# EAGLE design aardvark-v0.80 (EAGLE 9.6.2)
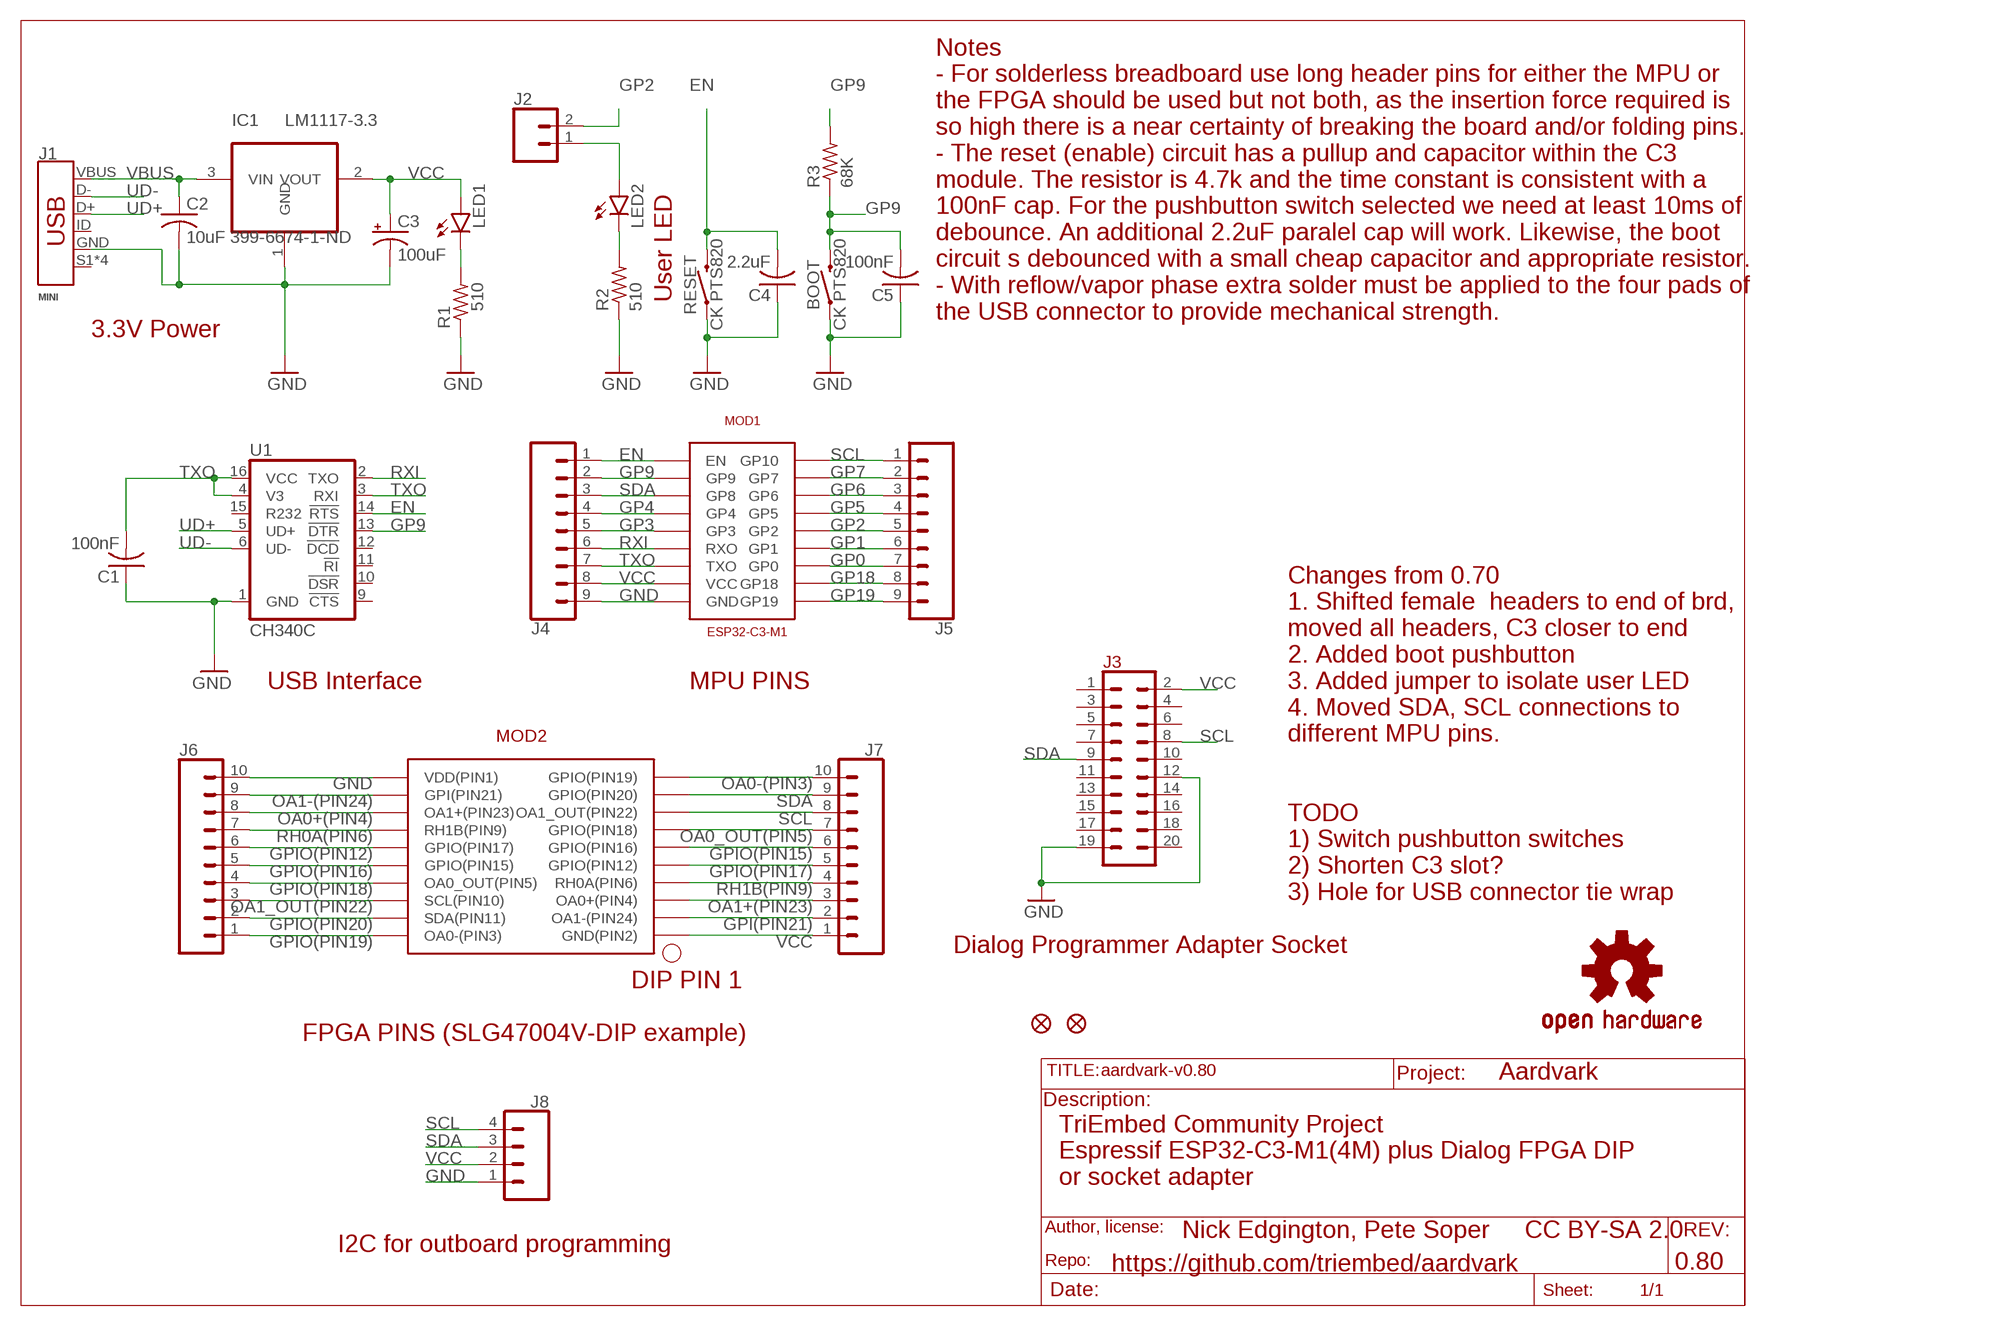
[diagram p0: schematic, sheet 1]

## Parts
BOOT  CK PTS820  MOMENTARY-SWITCH-SPST-SMD-6.0X3.5MM  [TACTILE_SWITCH_SMD_6.0X3.5MM]
C1  100nF  C-USC0805  [C0805]
C2  10uF 399-6674-1-ND  C-USC0805  [C0805]
C3  100uF  47UF-POLAR-PANASONIC_D-50V-20%  [PANASONIC_D]
C4  2.2uF  C-USC0805  [C0805]
C5  100nF  C-USC0805  [C0805]
FD1  FIDUCIAL1X2  [FIDUCIAL-1X2]
FD2  FIDUCIAL1X2  [FIDUCIAL-1X2]
IC1  LM1117-3.3  REG1117  [SOT223]
J1  MINI  USB_MINI-B_SMT  [USB-MINIB]
J2  CONN_02  [1X02]
J3  CONN_10X2  [2X10]
J4  CONN_09NO_SILK  [1X09_NO_SILK]
J5  CONN_09NO_SILK  [1X09_NO_SILK]
J6  CONN_10NO_SILK_PTH_FEMALE  [1X10_NO_SILK]
J7  CONN_10NO_SILK_PTH_FEMALE  [1X10_NO_SILK]
J8  CONN_041X04_NO_SILK  [1X04_NO_SILK]
LED1  LEDCHIP-LED0805  [CHIP-LED0805]
LED2  LEDCHIP-LED0805  [CHIP-LED0805]
LOGO1  OSHW-LOGOMINI  [OSHW-LOGO-MINI]
MOD1  ESP32-C3-M1  AITHINKER-C3-M1  [AITHINKER-C3-M1]
MOD2  SLG47004V_DIP  [SLG47004V-DIP]
R1  510  R-US_R0805  [R0805]
R2  510  R-US_R0805  [R0805]
R3  68K  R-US_R0805  [R0805]
RESET  CK PTS820  MOMENTARY-SWITCH-SPST-SMD-6.0X3.5MM  [TACTILE_SWITCH_SMD_6.0X3.5MM]
U1  CH340C  [SO016]

## Nets
EN: C4.2 J4.1 MOD1.PIN1(EN) RESET.2 U1.14(!RTS)
GND [power]: BOOT.1 C1.1 C2.2 C3.- C4.1 C5.1 IC1.1(GND) J1.GND J3.12 J3.19 J4.9 J6.10 J8.1 MOD1.PIN9(GND) MOD2.1(VDD(PIN1)) R1.1 R2.1 RESET.1 U1.1(GND)
GP0: J5.7 MOD1.PIN12(GP0)
GP1: J5.6 MOD1.PIN13(GP1)
GP2: J2.1 J2.2 J5.5 LED2.A MOD1.PIN14(GP2)
GP3: J4.5 MOD1.PIN5(GP3)
GP4: J4.4 MOD1.PIN4(GP4)
GP5: J5.4 MOD1.PIN15(GP5)
GP6: J5.3 MOD1.PIN16(GP6)
GP7: J5.2 MOD1.PIN17(GP7)
GP9: BOOT.2 C5.2 J4.2 MOD1.PIN2(GP9) R3.1 R3.2 U1.13(!DTR)
GP18: J5.8 MOD1.PIN11(GP18)
GP19: J5.9 MOD1.PIN10(GP19)
GPI(PIN21): J7.2 MOD2.12(OA1-(PIN24))
GPIO(PIN12): J6.6 MOD2.5(GPIO(PIN17))
GPIO(PIN15): J7.6 MOD2.16(GPIO(PIN16))
GPIO(PIN16): J6.5 MOD2.6(GPIO(PIN15))
GPIO(PIN17): J7.5 MOD2.15(GPIO(PIN12))
GPIO(PIN18): J6.4 MOD2.7(OA0_OUT(PIN5))
GPIO(PIN19): J6.1 MOD2.10(OA0-(PIN3))
GPIO(PIN20): J6.2 MOD2.9(SDA(PIN11))
N$1: LED2.C R2.2
N$3: LED1.C R1.2
OA0+(PIN4): J6.8 MOD2.3(OA1+(PIN23))
OA0-(PIN3): J7.10 MOD2.20(GPIO(PIN19))
OA0_OUT(PIN5): J7.7 MOD2.17(GPIO(PIN18))
OA1+(PIN23): J7.3 MOD2.13(OA0+(PIN4))
OA1-(PIN24): J6.9 MOD2.2(GPI(PIN21))
OA1_OUT(PIN22): J6.3 MOD2.8(SCL(PIN10))
RH0A(PIN6): J6.7 MOD2.4(RH1B(PIN9))
RH1B(PIN9): J7.4 MOD2.14(RH0A(PIN6))
RXI: J4.6 MOD1.PIN6(RXO) U1.2(TXO)
SCL: J3.8 J5.1 J7.8 J8.4 MOD1.PIN18(GP10) MOD2.18(OA1_OUT(PIN22))
SDA: J3.9 J4.3 J7.9 J8.3 MOD1.PIN3(GP8) MOD2.19(GPIO(PIN20))
TXO: C1.2 J4.7 MOD1.PIN7(TXO) U1.3(RXI) U1.4(V3) U1.16(VCC)
UD+: J1.D+ U1.5(UD+)
UD-: J1.D- U1.6(UD-)
VBUS [power]: C2.1 IC1.3(VIN) J1.VBUS
VCC [power]: C3.+ IC1.2(VOUT) J3.2 J4.8 J7.1 J8.2 LED1.A MOD1.PIN8(VCC) MOD2.11(GND(PIN2))
Unconnected: J1.ID J1.S1(SHIELD) J1.S2(SHIELD) J1.S3(SHIELD) J1.S4(SHIELD) J3.1 J3.3 J3.4 J3.5 J3.6 J3.7 J3.10 J3.11 J3.13 J3.14 J3.15 J3.16 J3.17 J3.18 J3.20 U1.9(!CTS) U1.10(!DSR) U1.11(!RI) U1.12(!DCD) U1.15(R232)

## Notes on the sheet
- User LED
- Notes
  - For solderless breadboard use long header pins for either the MPU or
  the FPGA should be used but not both, as the insertion force required is
  so high there is a near certainty of breaking the board and/or folding pins.
  - The reset (enable) circuit has a pullup and capacitor within the C3
  module. The resistor is 4.7k and the time constant is consistent with a
  100nF cap. For the pushbutton switch selected we need at least 10ms of
  debounce. An additional 2.2uF paralel cap will work. Likewise, the boot
  circuit s debounced with a small cheap capacitor and appropriate resistor.
  - With reflow/vapor phase extra solder must be applied to the four pads of
  the USB connector to provide mechanical strength.
- 3.3V Power
- USB Interface | MPU PINS
- Changes from 0.70
  1. Shifted female  headers to end of brd,
  moved all headers, C3 closer to end
  2. Added boot pushbutton
  3. Added jumper to isolate user LED
  4. Moved SDA, SCL connections to
  different MPU pins.
- TODO
  1) Switch pushbutton switches
  2) Shorten C3 slot?
  3) Hole for USB connector tie wrap
- Dialog Programmer Adapter Socket
- DIP PIN 1
- FPGA PINS (SLG47004V-DIP example)
- Aardvark
- TriEmbed Community Project
  Espressif ESP32-C3-M1(4M) plus Dialog FPGA DIP
  or socket adapter
- Nick Edgington, Pete Soper     CC BY-SA 2.0
- I2C for outboard programming
- https://github.com/triembed/aardvark | 0.80

## Library data of the parts
BOOT RESET = SparkFun-Switches:MOMENTARY-SWITCH-SPST: Momentary Switch (Pushbutton) - SPST Normally-open (NO) SPST momentary switches (buttons, pushbuttons). Variants PTH-12MM - 12mm square, through-hole Momentary Pushbutton Switch - 12mm Square <https://www.sparkfun.com/products/9190> (COM-09190) PTH-6.0MM, PTH-6.0MM-KIT - 6.0mm square, through-hole Mini Pushbutton Switch <https://www.sparkfun.com/products/97> (COM-00097) KIT package intended for soldering kit's - only one side of pads' copper is exposed. PTH-RIGHT-ANGLE-KIT - Right-angle, through-hole Right Angle Tactile Button <https://www.sparkfun.com/products/10791> - Used on SparkFun BigTime Watch Kit <https://www.sparkfun.com/products/11734> SMD-12MM - 12mm square, surface-mount Tactile Button - SMD (12mm) <https://www.sparkfun.com/products/12993> (COM-12993) Used on SparkFun PicoBoard <https://www.sparkfun.com/products/11888> SMD-4.5MM - 4.5mm Square Trackball Switch Used on SparkFun Blackberry Trackballer Breakout <https://www.sparkfun.com/products/13169> SMD-4.6MMX2.8MM - 4.60mm x 2.80mm, surface mount Used on SparkFun SAMD21 Mini Breakout <https://www.sparkfun.com/products/13664> SMD-5.2MM, SMD-5.2-REDUNDANT - 5.2mm square, surface-mount Mini Pushbutton Switch - SMD <https://www.sparkfun.com/products/8720> (COM-08720) Used on Arduino Pro Mini <https://www.sparkfun.com/products/11114> REDUNDANT package connects both switch circuits together SMD-6.0X3.5MM - 6.0 x 3.5mm, surface mount Momentary Reset Switch SMD <https://www.sparkfun.com/products/8229> (COM-08229) SMD-6.2MM-TALL - 6.2mm square, surface mount Tactile Button - SMD (6mm) <https://www.sparkfun.com/products/12992> Used on SparkFun Digital Sandbox <https://www.sparkfun.com/products/12651> SMD-RIGHT-ANGLE - Right-angle, surface mount Used on SparkFun Block for Intel® Edison - Arduino <https://www.sparkfun.com/products/13036>; PROD_ID: SWCH-14278; SF_SKU: COM-08229
C1 C2 C4 C5 = rcl:C-US: CAPACITOR, American symbol; SPICEPREFIX: C
C3 = SparkFun-Capacitors:47UF-POLAR: 47µF polarized capacitors A capacitor is a passive two-terminal electrical component used to store electrical energy temporarily in an electric field.
FD1 FD2 = apexprotofactory:FIDUCIAL: Fiducial Alignment Points Derived from SparkFun library but with cream (paste) included in pad. This is necessary for stencil creation by OSH Stencils!!
IC1 = burr-brown:REG1117: 800mA and 1A Low Dropout (LDO) Positive Regulator 1.8V, 2.5V, 2.85V, 3.3V, 5V, and Adj; MPN: REG1117; OC_FARNELL: 1097566; OC_NEWARK: 14P6981
J1 = SparkFun-Connectors:USB_MINI-B: USB type Mini-B Connector Breaks out 5th pin, and includes shield pins if needed. SparkFun Products: SparkFun FTDI Basic Breakout <https://www.sparkfun.com/products/9716> SparkFun XBee Explorer USB <https://www.sparkfun.com/products/11812> SparkFun Redboard <https://www.sparkfun.com/products/12757>; PROD_ID: CONN-08193; SF_ID: PRT-00587
J2 = SparkFun-Connectors:CONN_02: Multi connection point. Often used as Generic Header-pin footprint for 0.1 inch spaced/style header connections On any of the 0.1 inch spaced packages, you can populate with these: Break Away Headers - Straight <https://www.sparkfun.com/products/116> (PRT-00116) Break Away Male Headers - Right Angle <https://www.sparkfun.com/products/553> (PRT-00553) Female Headers <https://www.sparkfun.com/products/115> (PRT-00115) Break Away Headers - Machine Pin <https://www.sparkfun.com/products/117> (PRT-00117) Break Away Female Headers - Swiss Machine Pin <https://www.sparkfun.com/products/743> (PRT-00743) For SCREWTERMINALS and SPRING TERMINALS visit here: Screw Terimnals on SparkFun.com <https://www.sparkfun.com/search/results?term=Screw+Terminals> (5mm/3.5mm/2.54mm spacing) This device is also useful as a general connection point to wire up your design to another part of your project. Our various solder wires solder well into these plated through hole pads. Hook-Up Wire - Assortment (Stranded, 22 AWG) <https://www.sparkfun.com/products/11375> (PRT-11375) Hook-Up Wire - Assortment (Solid Core, 22 AWG) <https://www.sparkfun.com/products/11367> (PRT-11367) View the entire wire category on our website here <https://www.sparkfun.com/categories/141> Special notes: Molex polarized connector foot print use with: PRT-08233 with associated crimp pins and housings. 2.54_SCREWTERM for use with PRT-10571. 3.5mm Screw Terminal footprints for PRT-08084 5mm Screw Terminal footprints for use with PRT-08432
J3 = SparkFun-Connectors:CONN_10X2: Multi connection point. Often used as Generic Header-pin footprint for 0.1 inch spaced/style header connections On any of the 0.1 inch spaced packages, you can populate with these: Break Away Headers - Straight <https://www.sparkfun.com/products/116> (PRT-00116) Break Away Male Headers - Right Angle <https://www.sparkfun.com/products/553> (PRT-00553) Female Headers <https://www.sparkfun.com/products/115> (PRT-00115) Break Away Headers - Machine Pin <https://www.sparkfun.com/products/117> (PRT-00117) Break Away Female Headers - Swiss Machine Pin <https://www.sparkfun.com/products/743> (PRT-00743) Special note about the "SPECIAL" package: This was SPECIALLY designed to be used with our Graphic LCD Backpack. Be sure you want to use this! It is not only staggered on each line of header holes, but IT IS ALSO offset of the center point of the top and bottom lines by 5 mil. This causes the headers to lock into place on the "standard" footprint on the LCD screen. The extra squares on the tdocu layer are there simply to reference other pins (if you were to actually populate a longer header than ten long - this is what we do with the backpacks).
J4 J5 = SparkFun-Connectors:CONN_09: Multi connection point. Often used as Generic Header-pin footprint for 0.1 inch spaced/style header connections On any of the 0.1 inch spaced packages, you can populate with these: Break Away Headers - Straight <https://www.sparkfun.com/products/116> (PRT-00116) Break Away Male Headers - Right Angle <https://www.sparkfun.com/products/553> (PRT-00553) Female Headers <https://www.sparkfun.com/products/115> (PRT-00115) Break Away Headers - Machine Pin <https://www.sparkfun.com/products/117> (PRT-00117) Break Away Female Headers - Swiss Machine Pin <https://www.sparkfun.com/products/743> (PRT-00743) For SCREWTERMINALS and SPRING TERMINALS visit here: Screw Terimnals on SparkFun.com <https://www.sparkfun.com/search/results?term=Screw+Terminals> (5mm/3.5mm/2.54mm spacing) This device is also useful as a general connection point to wire up your design to another part of your project. Our various solder wires solder well into these plated through hole pads. Hook-Up Wire - Assortment (Stranded, 22 AWG) <https://www.sparkfun.com/products/11375> (PRT-11375) Hook-Up Wire - Assortment (Solid Core, 22 AWG) <https://www.sparkfun.com/products/11367> (PRT-11367) View the entire wire category on our website here <https://www.sparkfun.com/categories/141> Special notes: Molex polarized connector foot print use with SKU : PRT-08231 with associated crimp pins and housings. 1MM SMD Version SKU: PRT-10208 NOTES ON THE VARIANTS LOCK and LOCK_LONGPADS... This footprint was designed to help hold the alignment of a through-hole component (i.e. 6-pin header) while soldering it into place. You may notice that each hole has been shifted either up or down by 0.005 of an inch from it's more standard position (which is a perfectly straight line). This slight alteration caused the pins (the squares in the middle) to touch the edges of the holes. Because they are alternating, it causes a "brace" to hold the component in place. 0.005 has proven to be the perfect amount of "off-center" position when using our standard breakaway headers. Although looks a little odd when you look at the bare footprint, once you have a header in there, the alteration is very hard to notice. Also,if you push a header all the way into place, it is covered up entirely on the bottom side.
J6 J7 = SparkFun-Connectors:CONN_10: Multi connection point. Often used as Generic Header-pin footprint for 0.1 inch spaced/style header connections On any of the 0.1 inch spaced packages, you can populate with these: Break Away Headers - Straight <https://www.sparkfun.com/products/116> (PRT-00116) Break Away Male Headers - Right Angle <https://www.sparkfun.com/products/553> (PRT-00553) Female Headers <https://www.sparkfun.com/products/115> (PRT-00115) Break Away Headers - Machine Pin <https://www.sparkfun.com/products/117> (PRT-00117) Break Away Female Headers - Swiss Machine Pin <https://www.sparkfun.com/products/743> (PRT-00743) Arduino Stackable Header - 10 Pin <https://www.sparkfun.com/products/11376> (PRT-11376) For SCREWTERMINALS and SPRING TERMINALS visit here: Screw Terimnals on SparkFun.com <https://www.sparkfun.com/search/results?term=Screw+Terminals> (5mm/3.5mm/2.54mm spacing) This device is also useful as a general connection point to wire up your design to another part of your project. Our various solder wires solder well into these plated through hole pads. Hook-Up Wire - Assortment (Stranded, 22 AWG) <https://www.sparkfun.com/products/11375> (PRT-11375) Hook-Up Wire - Assortment (Solid Core, 22 AWG) <https://www.sparkfun.com/products/11367> (PRT-11367) View the entire wire category on our website here <https://www.sparkfun.com/categories/141> Special notes: Molex polarized connector foot print use with SKU : PRT-08231 with associated crimp pins and housings. 1MM SMD Version SKU: PRT-10208 NOTES ON THE VARIANTS LOCK and LOCK_LONGPADS... This footprint was designed to help hold the alignment of a through-hole component (i.e. 6-pin header) while soldering it into place. You may notice that each hole has been shifted either up or down by 0.005 of an inch from it's more standard position (which is a perfectly straight line). This slight alteration caused the pins (the squares in the middle) to touch the edges of the holes. Because they are alternating, it causes a "brace" to hold the component in place. 0.005 has proven to be the perfect amount of "off-center" position when using our standard breakaway headers. Although looks a little odd when you look at the bare footprint, once you have a header in there, the alteration is very hard to notice. Also,if you push a header all the way into place, it is covered up entirely on the bottom side.
J8 = SparkFun-Connectors:CONN_04: Multi connection point. Often used as Generic Header-pin footprint for 0.1 inch spaced/style header connections On any of the 0.1 inch spaced packages, you can populate with these: Break Away Headers - Straight <https://www.sparkfun.com/products/116> (PRT-00116) Break Away Male Headers - Right Angle <https://www.sparkfun.com/products/553> (PRT-00553) Female Headers <https://www.sparkfun.com/products/115> (PRT-00115) Break Away Headers - Machine Pin <https://www.sparkfun.com/products/117> (PRT-00117) Break Away Female Headers - Swiss Machine Pin <https://www.sparkfun.com/products/743> (PRT-00743) For SCREWTERMINALS and SPRING TERMINALS visit here: Screw Terimnals on SparkFun.com <https://www.sparkfun.com/search/results?term=Screw+Terminals> (5mm/3.5mm/2.54mm spacing) This device is also useful as a general connection point to wire up your design to another part of your project. Our various solder wires solder well into these plated through hole pads. Hook-Up Wire - Assortment (Stranded, 22 AWG) <https://www.sparkfun.com/products/11375> (PRT-11375) Hook-Up Wire - Assortment (Solid Core, 22 AWG) <https://www.sparkfun.com/products/11367> (PRT-11367) View the entire wire category on our website here <https://www.sparkfun.com/categories/141> Special notes: Molex polarized connector foot print use with SKU : PRT-08231 with associated crimp pins and housings. 1MM SMD Version SKU: PRT-10208; PROD_ID: CONN-09696
LED1 LED2 = led:LED: LED OSRAM: - CHIPLED LG R971, LG N971, LY N971, LG Q971, LY Q971, LO R971, LY R971 LH N974, LH R974 LS Q976, LO Q976, LY Q976 LO Q996 - Hyper CHIPLED LW Q18S LB Q993, LB Q99A, LB R99A - SideLED LS A670, LO A670, LY A670, LG A670, LP A670 LB A673, LV A673, LT A673, LW A673 LH A674 LY A675 LS A676, LA A676, LO A676, LY A676, LW A676 LS A679, LY A679, LG A679 - Hyper Micro SIDELED® LS Y876, LA Y876, LO Y876, LY Y876 LT Y87S - SmartLED LW L88C, LW L88S LB L89C, LB L89S, LG L890 LS L89K, LO L89K, LY L89K LS L896, LA L896, LO L896, LY L896 - TOPLED LS T670, LO T670, LY T670, LG T670, LP T670 LSG T670, LSP T670, LSY T670, LOP T670, LYG T670 LG T671, LOG T671, LSG T671 LB T673, LV T673, LT T673, LW T673 LH T674 LS T676, LA T676, LO T676, LY T676, LB T676, LH T676, LSB T676, LW T676 LB T67C, LV T67C, LT T67C, LS T67K, LO T67K, LY T67K, LW E67C LS E67B, LA E67B, LO E67B, LY E67B, LB E67C, LV E67C, LT E67C LW T67C LS T679, LY T679, LG T679 LS T770, LO T770, LY T770, LG T770, LP T770 LB T773, LV T773, LT T773, LW T773 LH T774 LS E675, LA E675, LY E675, LS T675 LS T776, LA T776, LO T776, LY T776, LB T776 LHGB T686 LT T68C, LB T68C - Hyper Mini TOPLED® LB M676 - Mini TOPLED Santana® LG M470 LS M47K, LO M47K, LY M47K Source: http://www.osram.convergy.de LUXEON: - LUMILED® LXK2-PW12-R00, LXK2-PW12-S00, LXK2-PW14-U00, LXK2-PW14-V00 LXK2-PM12-R00, LXK2-PM12-S00, LXK2-PM14-U00 LXK2-PE12-Q00, LXK2-PE12-R00, LXK2-PE12-S00, LXK2-PE14-T00, LXK2-PE14-U00 LXK2-PB12-K00, LXK2-PB12-L00, LXK2-PB12-M00, LXK2-PB14-N00, LXK2-PB14-P00, LXK2-PB14-Q00 LXK2-PR12-L00, LXK2-PR12-M00, LXK2-PR14-Q00, LXK2-PR14-R00 LXK2-PD12-Q00, LXK2-PD12-R00, LXK2-PD12-S00 LXK2-PH12-R00, LXK2-PH12-S00 LXK2-PL12-P00, LXK2-PL12-Q00, LXK2-PL12-R00 Source: www.luxeon.com KINGBRIGHT: KA-3528ASYC Source: www.kingbright.com
LOGO1 = SparkFun-Aesthetics:OSHW-LOGO: Open-Source Hardware (OSHW) Logo This logo indicates the piece of hardware it is found on incorporates a OSHW license and/or adheres to the definition of open source hardware found here: http://freedomdefined.org/OSHW
MOD1 = aithinker-C3-M1:AITHINKER-C3-M1: ESPRESSIF ESP32 C3 M1 module from AI Thinker
MOD2 = SLG47004V-DIP:SLG47004V_DIP
R1-R3 = rcl:R-US_: RESISTOR, American symbol; SPICEPREFIX: R
U1 = SparkFun-IC-Comms:CH340C; PROD_ID: IC-14038

## Net classes
0 default: width 0.203 mm
1 power: width 0.381 mm

## Board
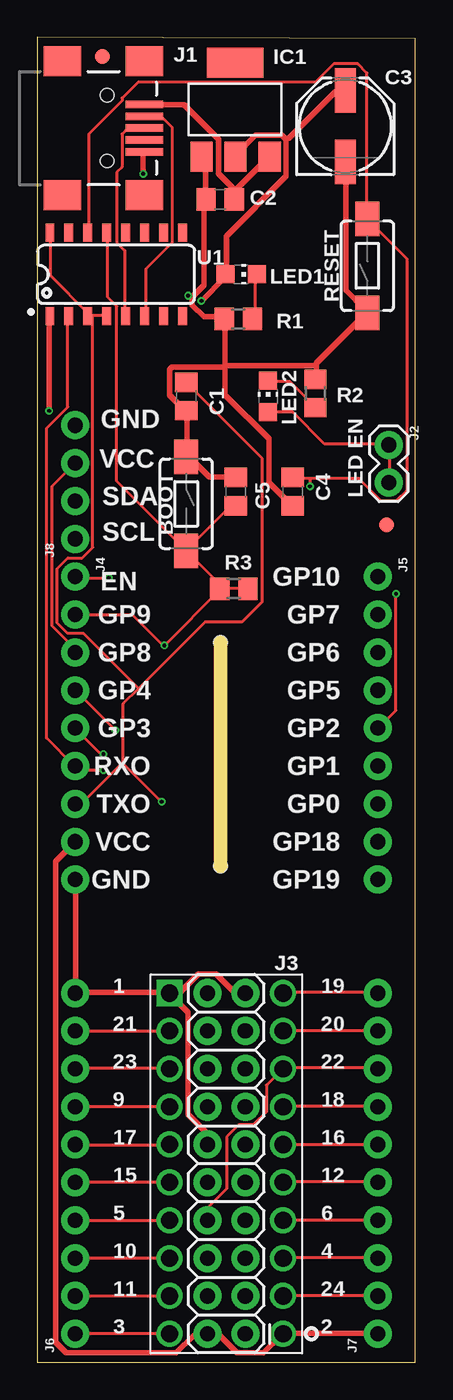
[diagram p1: board, top side]
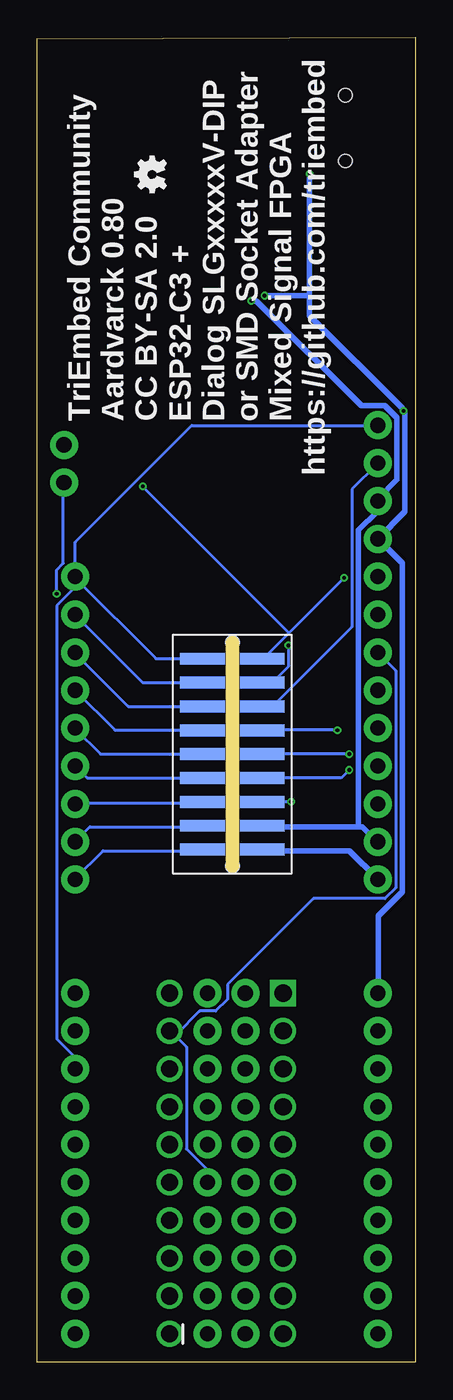
[diagram p2: board, bottom side, seen from below]

Size 25.4 x 88.9 mm. Coordinates in mm from the lower left corner, seen from the top.
Outline: 0,0 25.4,0 25.4,88.8 0,88.9 0,0
Copper layers (1*16): Top 0.035559375mm / dielectric 1.6mm / Bottom 0.035559375mm
Design rules "oshpark-2layer": minimum track width 6mil, minimum drill 10mil, track to track 6mil, track to pad 6mil, pad to pad 6mil, via to via 6mil, smd to smd 6mil, copper to edge 15mil, drill to drill 6mil, minimum pad ring 5mil, minimum via ring 5mil, stop-mask expansion 2.5mil, vias tented up to drill 0mil, thermal gap 10mil

### Footprints (pad centres in the part's own frame; a part is rotated, then mirrored left to right if it is on the bottom)
TACTILE_SWITCH_SMD_6.0X3.5MM = smd 2.3 x 1.6: 1 -3.15,0; 2 3.15,0
C0805 = smd 1.3 x 1.5: 1 -0.95,0; 2 0.95,0
PANASONIC_D = smd 3 x 1.4: + 2.4,0; - -2.4,0
FIDUCIAL-1X2 = smd 1 x 1: 1 0,0
SOT223 = smd 1.499 x 2.007: 1 -2.261,-3.15; 2 0.025,-3.15; 3 2.311,-3.15 | smd 3.81 x 2.007: 4 0,3.15
USB-MINIB = smd 2.5 x 0.5: D+ 2.5,0; D- 2.5,0.8; GND 2.5,-1.6; ID 2.5,-0.8; VBUS 2.5,1.6 | smd 2.5 x 2: S1 -3,4.5; S2 2.5,4.5; S3 -3,-4.5; S4 2.5,-4.5 | hole 0.9: 0,2.2; 0,-2.2
1X02 = drill 1.016 pad 1.88: 1 0,0; 2 2.54,0
2X10 = drill 1.016 pad 1.88: 1 0,0; 2 0,2.54; 3 2.54,0; 4 2.54,2.54; 5 5.08,0; 6 5.08,2.54; 7 7.62,0; 8 7.62,2.54; 9 10.16,0; 10 10.16,2.54; 11 12.7,0; 12 12.7,2.54; 13 15.24,0; 14 15.24,2.54; 15 17.78,0; 16 17.78,2.54; 17 20.32,0; 18 20.32,2.54; 19 22.86,0; 20 22.86,2.54
1X09_NO_SILK = drill 1.016 pad 1.88: 1 0,0; 2 2.54,0; 3 5.08,0; 4 7.62,0; 5 10.16,0; 6 12.7,0; 7 15.24,0; 8 17.78,0; 9 20.32,0
1X10_NO_SILK = drill 1.016 pad 1.88: 1 0,0; 2 2.54,0; 3 5.08,0; 4 7.62,0; 5 10.16,0; 6 12.7,0; 7 15.24,0; 8 17.78,0; 9 20.32,0; 10 22.86,0
1X04_NO_SILK = drill 1.016 pad 1.88: 1 0,0; 2 2.54,0; 3 5.08,0; 4 7.62,0
CHIP-LED0805 = smd 1.2 x 1.2: A 0,-1.05; C 0,1.05
AITHINKER-C3-M1 = smd 0.8 x 3 bottom: PIN1 -6.4,-2; PIN2 -4.8,-2; PIN3 -3.2,-2; PIN4 -1.6,-2; PIN5 0,-2; PIN6 1.6,-2; PIN7 3.2,-2; PIN8 4.8,-2; PIN9 6.4,-2; PIN10 6.4,2; PIN11 4.8,2; PIN12 3.2,2; PIN13 1.6,2; PIN14 0,2; PIN15 -1.6,2; PIN16 -3.2,2; PIN17 -4.8,2; PIN18 -6.4,2 | hole 0.9: -7.5,0; 7.5,0
SLG47004V-DIP = drill 1.15 pad 1.75 square: 1 -5.08,-3.81 | drill 1.15 pad 1.75: 2 -2.54,-3.81; 3 0,-3.81; 4 2.54,-3.81; 5 5.074,-3.81; 6 7.62,-3.81; 7 10.16,-3.81; 8 12.7,-3.81; 9 15.24,-3.81; 10 17.78,-3.81; 11 17.78,3.81; 12 15.24,3.81; 13 12.7,3.81; 14 10.16,3.81; 15 7.62,3.81; 16 5.08,3.81; 17 2.54,3.81; 18 0,3.81; 19 -2.54,3.81; 20 -5.08,3.81
R0805 = smd 1.3 x 1.5: 1 -0.95,0; 2 0.95,0
SO016 = smd 0.6 x 1.2: 1 -4.445,-2.8; 2 -3.175,-2.8; 3 -1.905,-2.8; 4 -0.635,-2.8; 5 0.635,-2.8; 6 1.905,-2.8; 7 3.175,-2.8; 8 4.445,-2.8; 9 4.445,2.8; 10 3.175,2.8; 11 1.905,2.8; 12 0.635,2.8; 13 -0.635,2.8; 14 -1.905,2.8; 15 -3.175,2.8; 16 -4.445,2.8

### Placement (x,y rotation side)
BOOT  10,57.6 270 top
C1  10,64.8 90 top
C2  10uF  [C0805]  12.29,78.02 180 top
C3  20.69,82.93 90 top
C4  17.14,58.42 90 top
C5  13.34,58.42 270 top
FD1  4.38,87.6 0 top
FD2  23.46,56.2 0 top
IC1  13.29,84.05 0 top
J1  4.7,82.8 0 top
J2  23.61,61.55 270 top
J3  13.97,1.91 90 top
J4  2.54,52.7 270 top
J5  22.86,52.7 270 top
J6  2.54,1.91 90 top
J7  22.86,1.91 90 top
J8  2.54,55.24 90 top
LED1  13.7,73 270 top
LED2  15.5,64.8 0 top
LOGO1  17.7,79.69 90 bottom
MOD1  12.3,40.8 270 top
MOD2  12.7,19.68 270 top
R1  13.5,70 0 top
R2  18.68,65 270 top
R3  13.2,51.9 0 top
RESET  22.17,73.56 90 top
U1  5.3,73 0 top

### Tracks (layer width: path | path; a pad name or v marks a point on that pad's centre or on a via)
EN  (via drill 0.25)
  Top 0.203: v4.8,52.63 2.58,52.63 J4.1 | U1.14 3.47,75.83 3.47,82.41 5.69,84.63 5.69,84.81 6.76,85.88 18.67,85.88 19.91,87.12 21.51,87.12 22.14,86.5 22.14,76.72 RESET.2 22.23,76.63 24.8,74.05 24.8,58.5 24.09,57.78 23.11,57.78 21.6,59.3 18.31,59.3 | 18.31,59.3 17.16,59.3 C4.2 | 18.31,59.3 v18.31,58.76
  Bottom 0.203: v4.8,52.63 8.49,48.94 | 8.49,48.94 10.22,47.21 MOD1.PIN1 | v18.31,58.76 8.49,48.94
GND  (via drill 0.25)
  Top 0.381: MOD2.1 8.89,24.8 2.58,24.8 J6.10 2.58,24.98 2.58,32.36 J4.9 | J3.12 11.38,14.67 11.38,15.38 10.13,16.62 10.13,23.47 8.98,24.62 MOD2.1 | J3.19 13.96,24.8 13.25,24.8 12,26.05 10.85,26.05 9.34,24.54 MOD2.1 | v0.8,63.83 0.8,70.14 U1.1 | v7.11,79.74 7.11,81.17 J1.GND | 18.76,66.85 18.76,67.03 22.14,70.41 RESET.1 22.05,70.59 20.71,71.92 20.71,80.45 C3.- | 18.76,66.85 18.76,65.96 R2.1 | C5.1 13.34,59.38 11.56,59.38 10.22,60.72 BOOT.1 10.05,60.81 10.05,63.83 C1.1 9.87,63.92 8.89,64.9 8.89,66.59 9.07,66.76 12.62,66.76 | IC1.1 11.11,80.9 11.29,80.72 11.29,78.05 C2.2 11.2,77.88 11.2,72.28 10.4,71.48 | 12.62,66.85 12.62,69.96 R1.1 12.45,70.14 11.2,70.14 10.4,70.94 10.4,71.48 | 12.62,66.85 12.62,66.76 | 12.62,66.76 12.62,64.9 15.56,61.96 15.56,59.03 17.07,57.52 C4.1 | 12.62,66.85 18.76,66.85 | v10.13,71.56 10.22,71.56 10.4,71.48
  Bottom 0.381: MOD1.PIN9 10.22,34.31 4.45,34.31 2.58,32.45 J4.9 | 7.11,71.56 7.11,70.23 0.89,64.01 v0.8,63.83 0.8,63.74 0.71,63.65 0.71,57.07 J8.1 2.4,55.12 0.89,53.61 0.89,31.56 2.49,29.96 2.49,24.8 J6.10 | 7.11,71.56 v7.11,79.74 | v10.13,71.56 7.11,71.56
GP0
  Bottom 0.203: MOD1.PIN12 14.31,37.52 22.85,37.52 J5.7
GP1
  Bottom 0.203: MOD1.PIN13 14.31,39.2 22.05,39.2 22.85,40.01 J5.6
GP2  (via drill 0.25)
  Top 0.203: LED2.A 15.56,63.74 17.16,63.74 19.29,61.61 23.56,61.61 J2.1 23.65,61.52 23.65,59.03 J2.2 | v24.09,51.56 24.09,43.74 22.94,42.58 J5.5
  Bottom 0.203: MOD1.PIN14 14.31,40.8 21.16,40.8 22.85,42.49 J5.5 | v24.09,51.56 24.09,53.16 23.65,53.61 23.65,58.94 J2.2
GP3  (via drill 0.25)
  Top 0.203: v4.45,40.8 4.27,40.8 2.58,42.49 J4.5
  Bottom 0.203: v4.45,40.8 10.22,40.8 MOD1.PIN5
GP4  (via drill 0.25)
  Top 0.203: v5.25,42.41 2.58,45.07 J4.4
  Bottom 0.203: v5.25,42.41 10.22,42.41 MOD1.PIN4
GP5
  Bottom 0.203: J5.4 20.18,42.41 14.31,42.41 MOD1.PIN15
GP6
  Bottom 0.203: MOD1.PIN16 14.31,44.01 19.29,44.01 22.85,47.56 J5.3
GP7
  Bottom 0.203: MOD1.PIN17 14.31,45.61 18.31,45.61 22.85,50.14 J5.2
GP9  (via drill 0.25)
  Top 0.203: R3.1 12.27,51.92 14.13,51.92 R3.2 | U1.13 4.71,75.74 4.71,71.48 5.33,70.85 5.33,59.12 9.96,54.5 BOOT.2 | BOOT.2 12.98,57.43 13.34,57.43 C5.2 | R3.1 12.27,52.01 12.27,52.18 10.05,54.41 BOOT.2 | R3.1 12.27,51.83 v8.53,48.09 8.45,48.09 6.4,50.14 2.58,50.14 J4.2
  Bottom 0.203: v8.53,48.09 8.53,46.67 9.6,45.61 10.22,45.61 MOD1.PIN2
GP18
  Bottom 0.203: J5.8 21.87,35.92 14.31,35.92 MOD1.PIN11
GP19
  Bottom 0.203: MOD1.PIN10 14.31,34.31 20.98,34.31 22.85,32.45 J5.9
GPI(PIN21)
  Top 0.203: J7.2 MOD2.12
GPIO(PIN12)
  Top 0.203: MOD2.5 8.89,14.58 2.58,14.58 J6.6
GPIO(PIN15)
  Top 0.203: MOD2.16 16.54,14.58 22.85,14.58 J7.6
GPIO(PIN16)
  Top 0.203: MOD2.6 8.89,12.09 2.58,12.09 J6.5
GPIO(PIN17)
  Top 0.203: MOD2.15 16.54,12.09 22.85,12.09 J7.5
GPIO(PIN18)
  Top 0.203: MOD2.7 2.58,9.51 J6.4
GPIO(PIN19)
  Top 0.203: MOD2.10 8.89,1.96 2.58,1.96 J6.1
GPIO(PIN20)
  Top 0.203: J6.2 MOD2.9
N$1
  Top 0.203: LED2.C 15.56,65.79 16.98,65.79 18.67,64.1 R2.2
N$3
  Top 0.203: LED1.C 14.67,72.99 14.67,70.23 14.49,70.05 R1.2
OA0+(PIN4)
  Top 0.203: MOD2.3 8.89,19.74 2.58,19.74 J6.8
OA0-(PIN3)
  Top 0.203: MOD2.20 16.54,24.8 22.85,24.8 J7.10
OA0_OUT(PIN5)
  Top 0.203: MOD2.17 16.54,17.16 22.85,17.16 J7.7
OA1+(PIN23)
  Top 0.203: MOD2.13 16.54,7.02 22.85,7.02 J7.3
OA1-(PIN24)
  Top 0.203: J6.9 MOD2.2
OA1_OUT(PIN22)
  Top 0.203: MOD2.8 8.89,7.02 2.58,7.02 J6.3
RH0A(PIN6)
  Top 0.203: MOD2.4 8.89,17.16 2.58,17.16 J6.7
RH1B(PIN9)
  Top 0.203: MOD2.14 16.54,9.51 22.85,9.51 J7.4
RXI  (via drill 0.25)
  Top 0.203: U1.2 2.04,70.14 2.04,64.1 0.62,62.67 0.62,41.87 2.49,40.01 J4.6 2.58,39.92 2.76,39.74 v4.45,39.74
  Bottom 0.203: v4.45,39.74 4.98,39.2 10.22,39.2 MOD1.PIN6
SCL
  Top 0.203: J7.8 22.85,19.74 16.54,19.74 MOD2.18 16.45,19.65 15.38,18.58 15.38,16.8 14.49,15.91 13.51,15.91 12.71,15.11 12.71,11.65 11.47,10.4 11.47,9.6 J3.8
  Bottom 0.203: MOD1.PIN18 14.31,47.21 17.42,47.21 22.85,52.63 J5.1 | J8.4 2.58,62.85 15.02,62.85 22.85,55.03 22.85,52.81 J5.1 | J7.8 22.94,19.74 22.94,20.54 24.09,21.69 24.09,50.76 22.58,52.27 J5.1
SDA
  Top 0.203: J7.9 MOD2.19 | J8.3 0.98,58.76 0.98,49.43 2.49,47.92 2.49,47.65 J4.3
  Bottom 0.203: J3.9 14.05,12.09 14.05,12.98 15.38,14.31 15.38,21.16 16.45,22.23 MOD2.19 16.09,21.96 14.49,23.56 13.42,23.56 12.62,24.36 12.62,25.34 6.84,31.11 2.04,31.11 1.33,31.83 1.33,46.41 2.49,47.56 J4.3 | MOD1.PIN3 10.22,44.01 9.6,44.01 4.27,49.34 4.27,58.59 2.58,60.27 J8.3
TXO  (via drill 0.25)
  Top 0.203: 3.73,70.23 4.62,70.23 U1.4 | 3.73,70.23 3.47,70.23 U1.3 3.47,70.32 0.89,72.9 0.89,75.74 U1.16 | 6.8,45.21 5.78,44.18 5.78,40.27 | 6.8,45.21 11.29,49.7 13.78,49.7 15.11,51.03 15.11,60.63 10.05,65.7 C1.2 | 5.78,40.27 3.02,37.52 2.58,37.52 J4.7 | v8.36,37.6 5.78,40.18 5.78,40.27 | 3.73,70.23 3.73,54.67 3.02,53.96 2.04,53.96 1.33,53.25 1.33,49.61 2.04,48.9 3.11,48.9 6.8,45.21
  Bottom 0.203: v8.36,37.6 10.22,37.6 MOD1.PIN7
UD+
  Top 0.203: U1.5 5.87,70.23 5.87,74.59 5.33,75.12 5.33,79.83 5.69,80.19 5.69,82.41 6.04,82.77 7.11,82.77 J1.D+
UD-
  Top 0.203: U1.6 7.29,70.23 7.29,73.34 9.07,75.12 9.07,82.86 8.36,83.57 7.2,83.57 J1.D-
VBUS
  Top 0.381: IC1.3 15.56,80.9 13.25,78.59 13.25,78.05 C2.1 13.16,78.77 12.18,79.74 12.18,82.06 9.87,84.37 7.2,84.37 J1.VBUS
VCC  (via drill 0.25)
  Top 0.381: 16.71,82.06 16.71,79.57 12.71,75.56 12.71,73.08 LED1.A 12.62,72.81 v11.02,71.21 | 16.71,82.06 16.45,82.32 14.67,82.32 13.34,80.99 IC1.2 | C3.+ 20.62,85.25 20,85.25 16.89,82.14 16.71,82.06 | J7.1 22.85,1.96 16.54,1.96 MOD2.11 16.36,1.78 15.2,0.62 13.42,0.62 12.18,1.87 11.47,1.87 J3.2 11.29,1.78 10.49,1.78 9.34,0.62 1.96,0.62 1.25,1.33 1.25,33.6 2.49,34.85 J4.8
  Bottom 0.381: 3.82,35.92 3.56,35.92 2.58,34.94 J4.8 | 3.82,35.92 10.22,35.92 MOD1.PIN8 | 3.82,35.92 3.82,55.83 2.58,57.07 2.58,57.78 J8.2 2.49,57.96 1.25,59.21 1.25,63.39 2.04,64.19 3.65,64.19 10.67,71.21 v11.02,71.21

### Text on the board
tNames: GND | VCC | LED EN | SDA | SCL | GP10 | EN | GP9 | GP7 | GP8 | GP6 | GP4 | GP5 | GP3 | GP2 | RXO | GP1 | TXO | GP0 | VCC | GP18 | GND | GP19
bNames: TriEmbed Community / Aardvarck 0.80 / CC BY-SA 2.0 / ESP32-C3 + / Dialog SLGxxxxxV-DIP / or SMD Socket Adapter / Mixed Signal FPGA / https://github.com/triembed